# EAGLE design H09R9 (EAGLE 9.6.1)

## Sheet 1 of 2
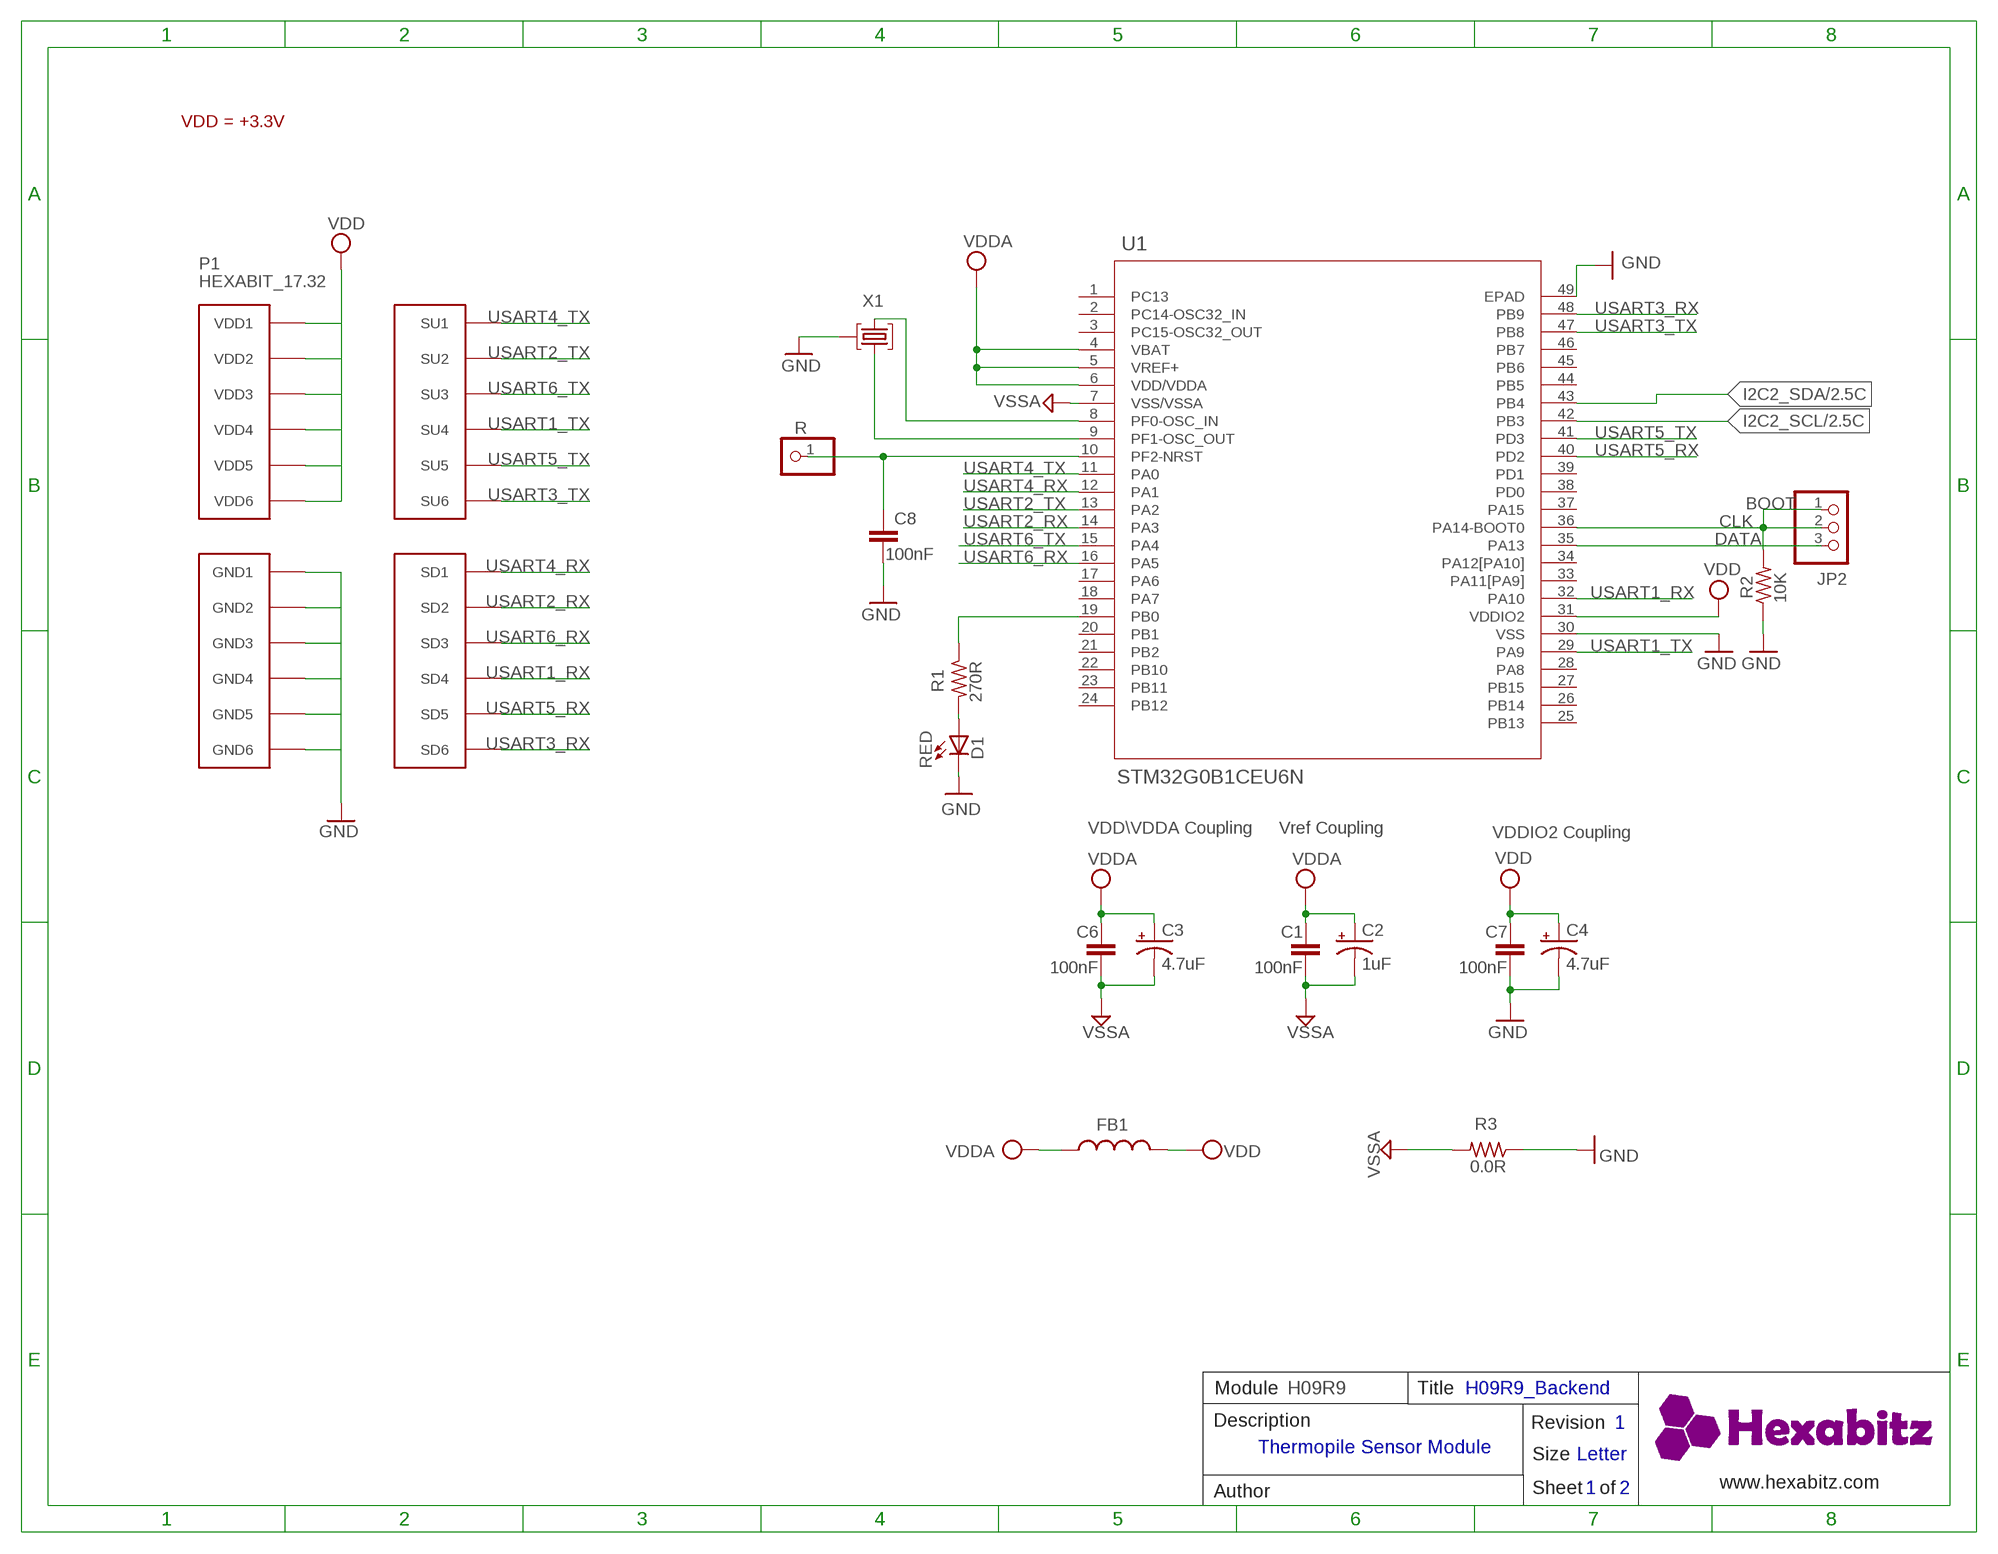
[diagram p0: schematic, sheet 1]

### Parts
C1  100nF  C-0603  [C-0603]
C2  1uF  C-0805-POL  [C-0805-POL]
C3  4.7uF  C-0805-POL  [C-0805-POL]
C4  4.7uF  C-0805-POL  [C-0805-POL]
C6  100nF  C-0603  [C-0603]
C7  100nF  C-0603  [C-0603]
C8  100nF  C-0603  [C-0603]
D1  RED  VLMS1300-GS08  [VLMS1300-GS08]
FB1  FB-TDK_MMZ1608Y300B  [FB-TDK_MMZ1608Y300B]
JP2  PINHD-1X3  [1X03]
P1  HEXABIT_17.32  [HEXABIT_17.32]
R  R  PINHD-1X1  [1X01]
R1  270R  R-0603  [R-0603]
R2  10K  R-0603  [R-0603]
R3  0.0R  R-0603  [R-0603]
U1  STM32G0B1CEU6N  [HEXABITZ_ICS_QFN_B1CEU6_STM-L]
X1  XTALL_CSTCE8M00G52  [XTALL_CSTCE8M00G52]

### Nets
CLK: JP2.1 JP2.2 R2.2 U1.36(PA14-BOOT0)
DATA: JP2.3 U1.35(PA13)
GND: C4.2(-) C7.2 C8.2 D1.C P1.PAD_PD7(GND1) P1.PAD_PD8(GND2) P1.PAD_PD9(GND3) P1.PAD_PD10(GND4) P1.PAD_PD11(GND5) P1.PAD_PD12(GND6) R2.1 R3.1 U1.30(VSS) U1.49(EPAD) X1.P$2 ; also sheet 2
I2C2_SCL: U1.42(PB3) ; also sheet 2
I2C2_SDA: U1.43(PB4) ; also sheet 2
N$1: R1.1 U1.19(PB0)
N$3: D1.A R1.2
N$4: C8.1 R.1 U1.10(PF2-NRST)
N$5: U1.9(PF1-OSC_OUT) X1.P$1
N$6: U1.8(PF0-OSC_IN) X1.P$3
USART1_RX: P1.PAD_PD4(SD4) U1.32(PA10)
USART1_TX: P1.PAD_PU4(SU4) U1.29(PA9)
USART2_RX: P1.PAD_PD2(SD2) U1.14(PA3)
USART2_TX: P1.PAD_PU2(SU2) U1.13(PA2)
USART3_RX: P1.PAD_PD6(SD6) U1.48(PB9)
USART3_TX: P1.PAD_PU6(SU6) U1.47(PB8)
USART4_RX: P1.PAD_PD1(SD1) U1.12(PA1)
USART4_TX: P1.PAD_PU1(SU1) U1.11(PA0)
USART5_RX: P1.PAD_PD5(SD5) U1.40(PD2)
USART5_TX: P1.PAD_PU5(SU5) U1.41(PD3)
USART6_RX: P1.PAD_PD3(SD3) U1.16(PA5)
USART6_TX: P1.PAD_PU3(SU3) U1.15(PA4)
VDD: C4.1(+) C7.1 FB1.2 P1.PAD_PU7(VDD1) P1.PAD_PU8(VDD2) P1.PAD_PU9(VDD3) P1.PAD_PU10(VDD4) P1.PAD_PU11(VDD5) P1.PAD_PU12(VDD6) U1.31(VDDIO2) ; also sheet 2
VDDA: C1.1 C2.1(+) C3.1(+) C6.1 FB1.1 U1.4(VBAT) U1.5(VREF+) U1.6(VDD/VDDA)
VSSA: C1.2 C2.2(-) C3.2(-) C6.2 R3.2 U1.7(VSS/VSSA)
Unconnected: U1.1(PC13) U1.2(PC14-OSC32_IN) U1.3(PC15-OSC32_OUT) U1.17(PA6) U1.18(PA7) U1.20(PB1) U1.21(PB2) U1.22(PB10) U1.23(PB11) U1.24(PB12) U1.25(PB13) U1.26(PB14) U1.27(PB15) U1.28(PA8) U1.33(PA11[PA9]) U1.34(PA12[PA10]) U1.37(PA15) U1.38(PD0) U1.39(PD1) U1.44(PB5) U1.45(PB6) U1.46(PB7)

### Notes on the sheet
- VDD = +3.3V
- BOOT
- VDD\VDDA Coupling | Vref Coupling | VDDIO2 Coupling
- Module | H09R9 | Title | H09R9_Backend
- Description | Revision | 1
- Thermopile Sensor Module
- Size | Letter
- www.hexabitz.com
- Author | Sheet   of | 1 | 2
- C:/Users/Admin/Desktop/logodraft.bmp

## Sheet 2 of 2
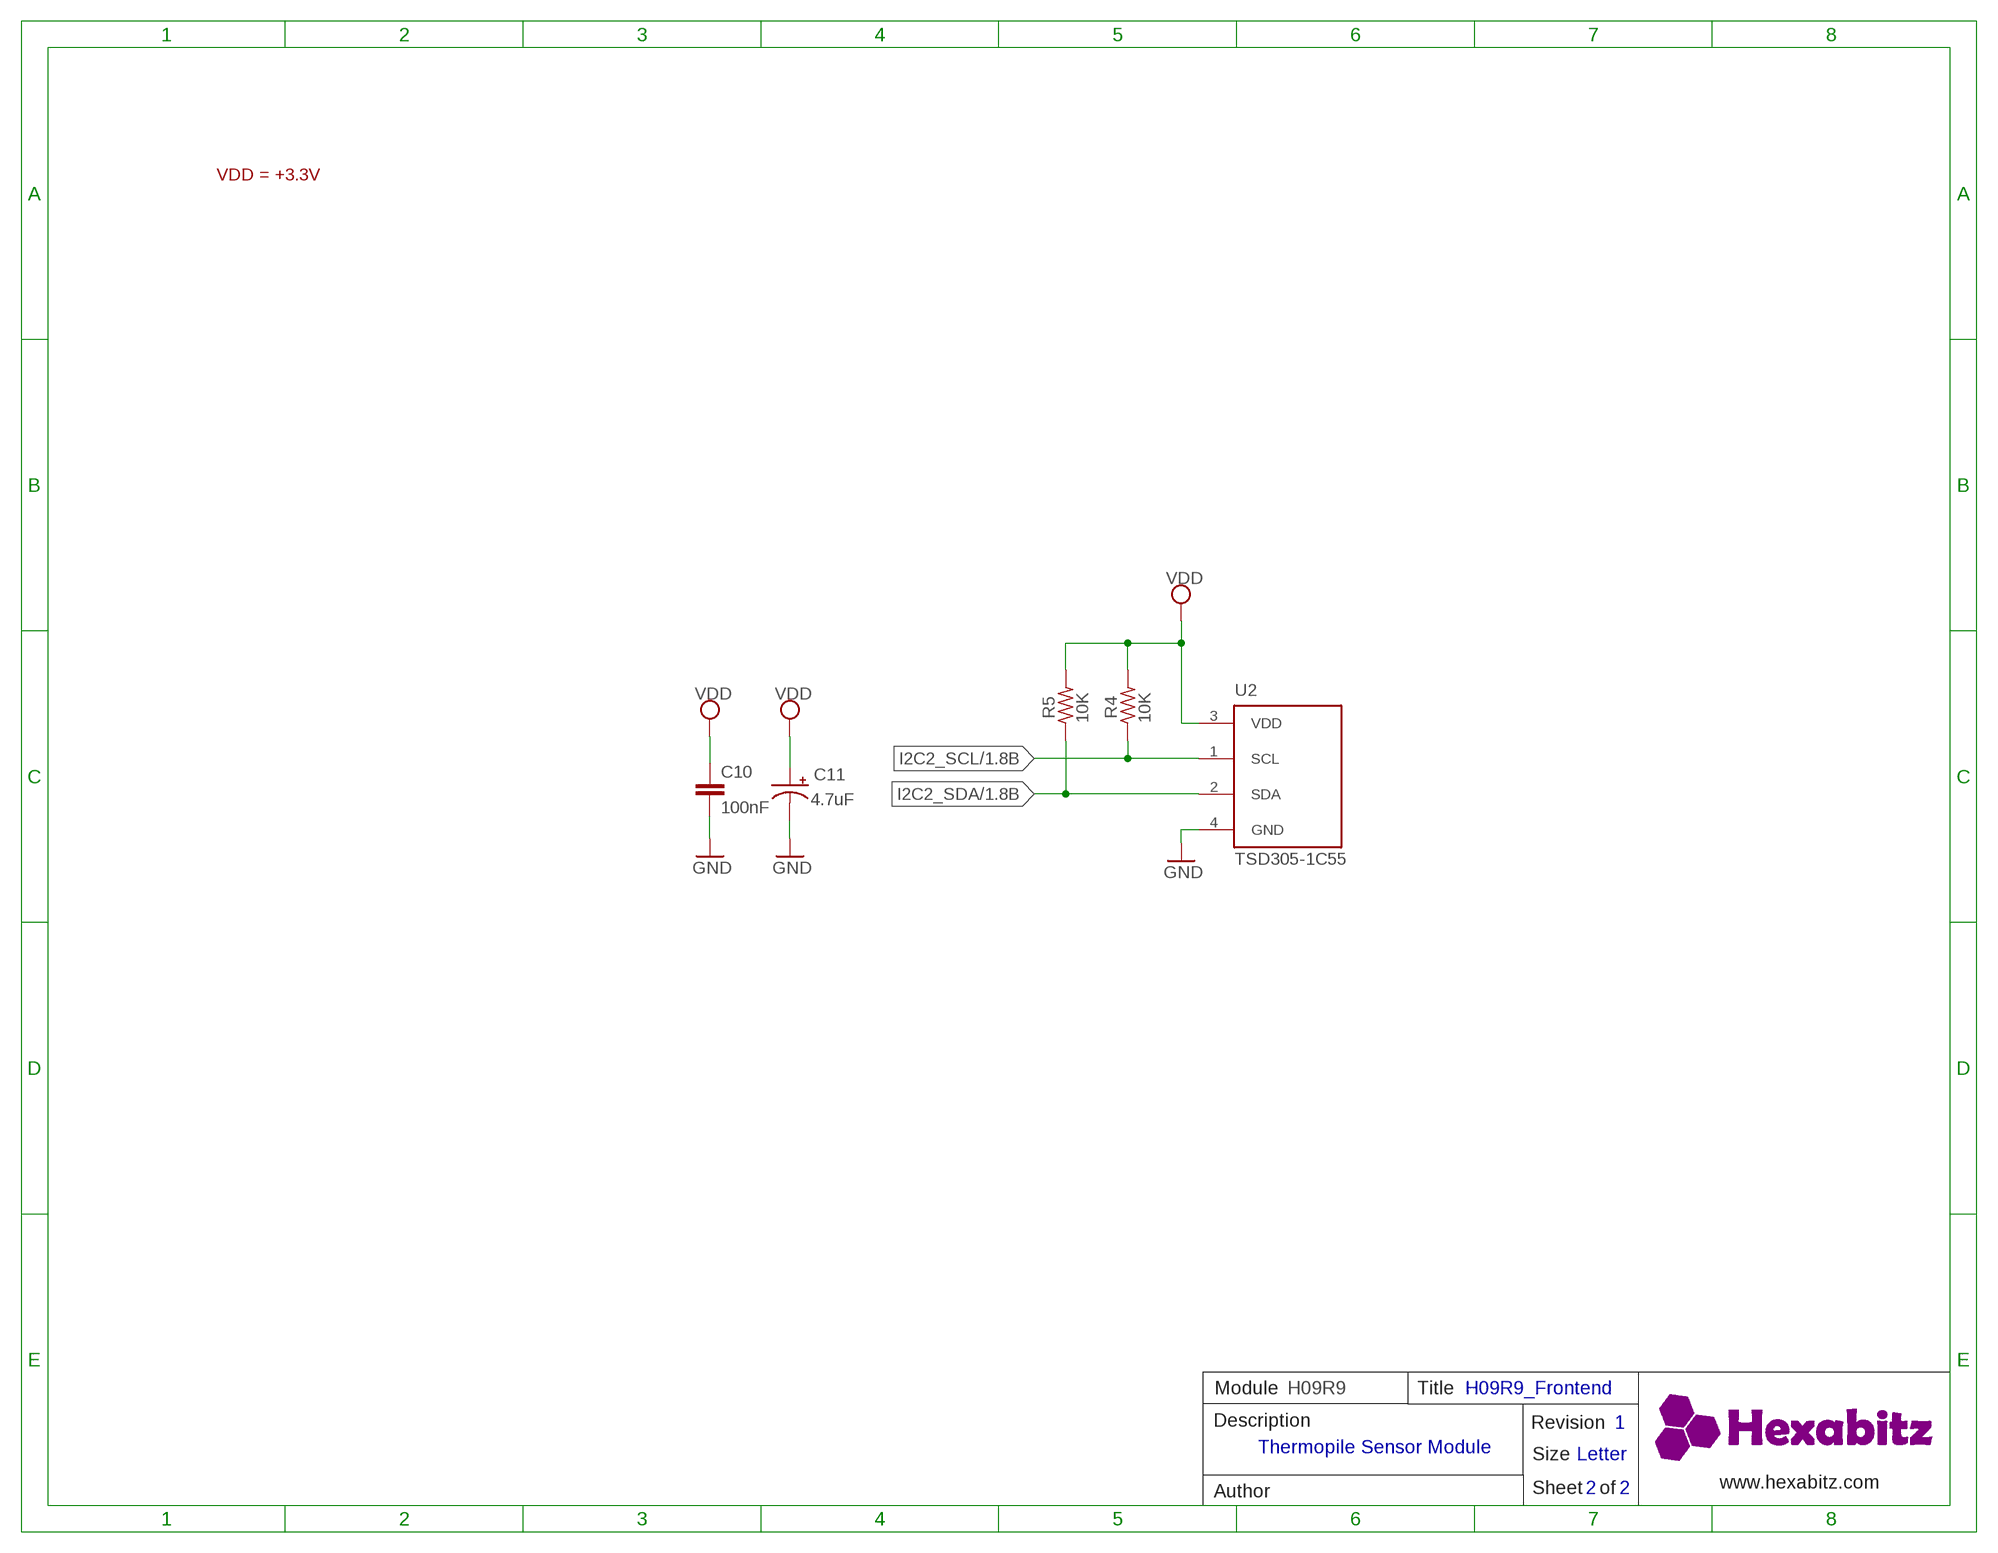
[diagram p1: schematic, sheet 2]

### Parts
C10  100nF  C-0603  [C-0603]
C11  4.7uF  C-0805-POL  [C-0805-POL]
R4  10K  R-0603  [R-0603]
R5  10K  R-0603  [R-0603]
U2  TSD305-1C55  [TEMPERATURESENSOR-TO5]

### Nets
GND: C10.2 C11.2(-) U2.4(GND) ; also sheet 1
I2C2_SCL: R4.1 U2.1(SCL) ; also sheet 1
I2C2_SDA: R5.1 U2.2(SDA) ; also sheet 1
VDD: C10.1 C11.1(+) R4.2 R5.2 U2.3(VDD) ; also sheet 1

### Notes on the sheet
- VDD = +3.3V
- Module | H09R9 | Title | H09R9_Frontend
- Description | Revision | 1
- Thermopile Sensor Module
- Size | Letter
- www.hexabitz.com
- Author | Sheet   of | 2 | 2

## Library data of the parts
C1 C6-C8 = HEXABITZ_RCLS:C-0603: CAP CER 10% X7R 0603
C2-C4 = HEXABITZ_RCLS:C-0805-POL: Cap Tant Solid SMD 2012
C10 = HEXABITZ_RCLS:C-0603: CAP CER 10% X7R 0603; CAPACITANCE: 100nF; MFN: AVX; MPN: 0603YC104K4T2A; OCTOPART_URL: https://octopart.com/0603yc104k4t2a-avx+interconnect+%2F+elco-8120651; TOLERANCE: 10%; VOLTAGE_RATING: 16.0 V
C11 = HEXABITZ_RCLS:C-0805-POL: Cap Tant Solid SMD 2012; CAPACITANCE: 4.7uF; MFN: Panasonic; MPN: 10TPU4R7MSI; OCTOPART_URL: https://octopart.com/10tpu4r7msi-panasonic-29487748; TOLERANCE: 20%; VOLTAGE_RATING: 10.0 V
D1 = HEXABITZ_USER_INTERFACE_PARTS:VLMS1300-GS08: Red 0603 130° Clear 54 mcd 2 V Surface Mount ChipLED ; Octopart Url : http://octopart.com/vlms1300-gs08-vishay-21709201; MFN: Vishay; MPN: VLMS1300-GS08; OCTOPART_URL: https://octopart.com/vlms1300-gs08-vishay-21709201?r=sp&s=_gcP4_q8T1SC6PJQPTQ9yA
FB1 = HEXABITZ_RCLS:FB-TDK_MMZ1608Y300B: Ferrite Beads Multi-Layer 30Ohm 25% 100MHz 1.5A 50mOhm DCR 0603; MFN: TDK; MPN: MMZ1608Y300B; OCTOPART_URL: https://octopart.com/mmz1608y300b-tdk-368280?r=sp&s=cd9_2ZEqQ9q9UNBuQgHAiA
JP2 = pinhead:PINHD-1X3: PIN HEADER
P1 = hexabitz_connectors:HEXABIT_?: Hexabitz Hexagon Module Connector Hexagon side length = 28.87mm.
R = HEXABITZ_USER_INTERFACE_PARTS:PINHD-1X1: PIN HEADER; MFN: TE Connectivity; MPN: 87227-1; OCTOPART_URL: https://octopart.com/87227-1-te+connectivity-39512052?r=sp
R1 R2 R4 R5 = HEXABITZ_RCLS:R-0603: Thick Film Resistors - SMD 0603
R3 = HEXABITZ_RCLS:R-0603: Thick Film Resistors - SMD 0603; MFN: Yageo; MPN: RC0603JR-070RL; OCTOPART_URL: https://octopart.com/rc0603jr-070rl-yageo-1241539?r=sp&s=X2NteqRjRNWrnx42Y0aliA; RESISTANCE: 0.0 Ohm
U1 = HEXABITZ_ICs:STM32G0B1CEU6N
U2 = HEXABITZ_ICs:TSD305-1C55: I2C DIGITAL THERMOPILE SENSOR; MFN: TE Connectivity; MPN: G-TPMO-101; OCTOPART_URL: https://octopart.com/g-tpmo-101-te+connectivity-76900424?r=sp
X1 = HEXABITZ_RCLS:XTALL_CSTCE8M00G52: MURATA CSTCE8M00G52-R0 RESONATOR, SMD, 8MHZ ; Octopart Url : https://octopart.com/cstce8m00g52-r0-murata-7145559; MFN: Murata; MPN: CSTCE8M00G52Z-R0; OCTOPART_URL: https://octopart.com/cstce8m00g52z-r0-murata-17755941?r=sp&s=JDnNJnrHQhyS8Zk4ofFWXw

## Board
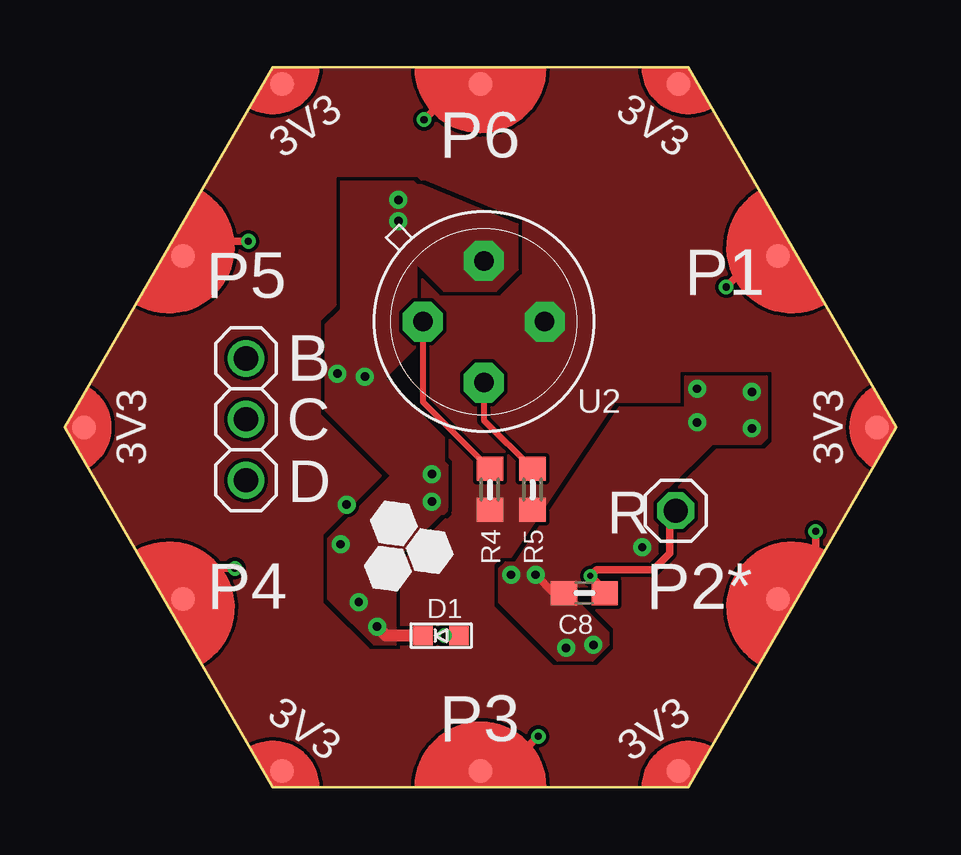
[diagram p2: board, top side]
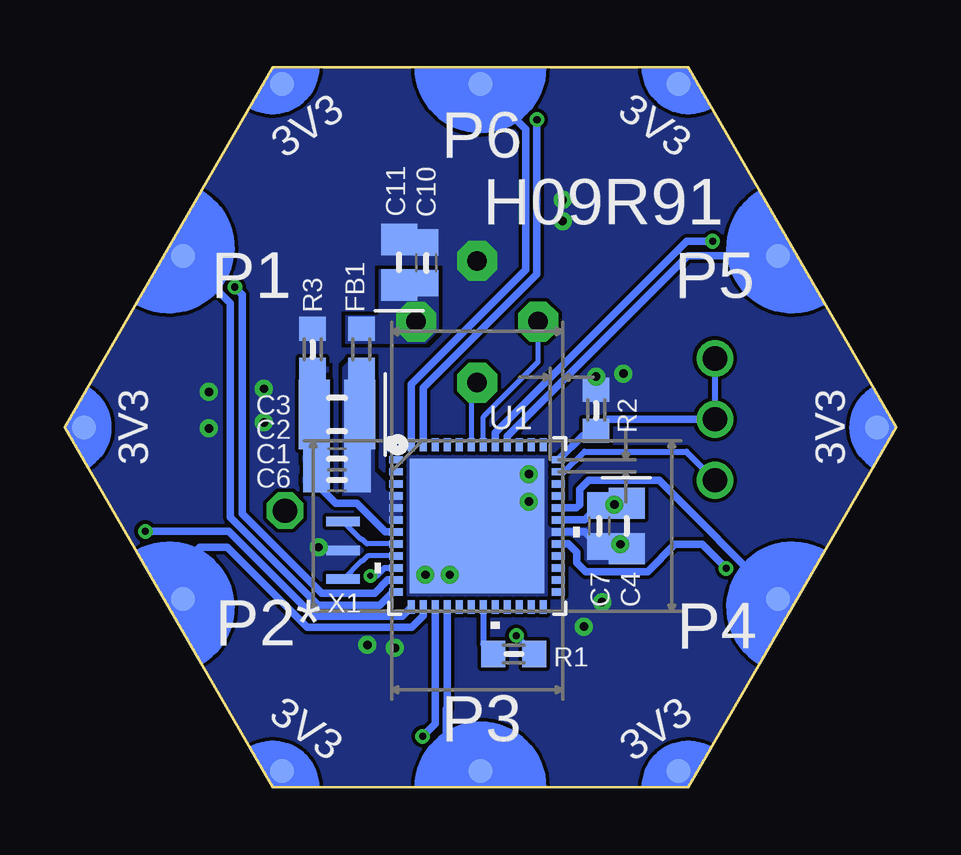
[diagram p3: board, bottom side, seen from below]

Size 34.64 x 30 mm. Coordinates in mm from the lower left corner, seen from the top.
Copper layers (1*16): Top 0.035mm / dielectric 1.5mm / Bottom 0.035mm
Design rules "2_layer *": minimum track width 7mil, minimum drill 0.2mm, track to track 6mil, track to pad 6mil, pad to pad 6mil, via to via 6mil, smd to smd 0mil, copper to edge 0mil, drill to drill 8mil, minimum pad ring 10mil, minimum via ring 6mil, stop-mask expansion 2mil, vias tented up to drill 15mil, thermal gap 10mil

### Footprints (pad centres in the part's own frame; a part is rotated, then mirrored left to right if it is on the bottom)
C-0603 = smd 1.1 x 1: 1 -0.85,0; 2 0.85,0
C-0805-POL = smd 1.3 x 1.5: 1 -0.95,0; 2 0.95,0
VLMS1300-GS08 = smd 0.8 x 0.8: A 0,0.75; C 0,-0.75
FB-TDK_MMZ1608Y300B = smd 1 x 1.1: 1 -0.85,0; 2 0.85,0
1X03 = drill 1.016: 1 -2.54,0; 2 0,0; 3 2.54,0
HEXABIT_17.32 = smd 1 x 1 bottom: PAD_PD1 12.39,7.15; PAD_PD2 12.39,-7.15; PAD_PD3 0,-14.31; PAD_PD4 -12.39,-7.15; PAD_PD5 -12.39,7.15; PAD_PD6 0,14.31; PAD_PD7 8.26,14.31; PAD_PD8 16.52,0; PAD_PD9 8.26,-14.31; PAD_PD10 -8.26,-14.31; PAD_PD11 -16.52,0; PAD_PD12 -8.26,14.31 | smd 1 x 1: PAD_PU1 12.39,7.15; PAD_PU2 12.39,-7.15; PAD_PU3 0,-14.31; PAD_PU4 -12.39,-7.15; PAD_PU5 -12.39,7.15; PAD_PU6 0,14.31; PAD_PU7 8.26,14.31; PAD_PU8 16.52,0; PAD_PU9 8.26,-14.31; PAD_PU10 -8.26,-14.31; PAD_PU11 -16.52,0; PAD_PU12 -8.26,14.31
1X01 = drill 1.016 octagon: 1 0,0
R-0603 = smd 1 x 1.1: 1 -0.85,0; 2 0.85,0
HEXABITZ_ICS_QFN_B1CEU6_STM-L = smd 0.55 x 0.297: 1 -3.38,2.751; 2 -3.38,2.251; 3 -3.38,1.75; 4 -3.38,1.25; 5 -3.38,0.75; 6 -3.38,0.25; 7 -3.38,-0.25; 8 -3.38,-0.75; 9 -3.38,-1.25; 10 -3.38,-1.75; 11 -3.38,-2.251; 12 -3.38,-2.751; 25 3.38,-2.751; 26 3.38,-2.251; 27 3.38,-1.75; 28 3.38,-1.25; 29 3.38,-0.75; 30 3.38,-0.25; 31 3.38,0.25; 32 3.38,0.75; 33 3.38,1.25; 34 3.38,1.75; 35 3.38,2.251; 36 3.38,2.751 | smd 0.297 x 0.55: 13 -2.751,-3.38; 14 -2.251,-3.38; 15 -1.75,-3.38; 16 -1.25,-3.38; 17 -0.75,-3.38; 18 -0.25,-3.38; 19 0.25,-3.38; 20 0.75,-3.38; 21 1.25,-3.38; 22 1.75,-3.38; 23 2.251,-3.38; 24 2.751,-3.38; 37 2.751,3.38; 38 2.251,3.38; 39 1.75,3.38; 40 1.25,3.38; 41 0.75,3.38; 42 0.25,3.38; 43 -0.25,3.38; 44 -0.75,3.38; 45 -1.25,3.38; 46 -1.75,3.38; 47 -2.251,3.38; 48 -2.751,3.38 | smd 5.6 x 5.6: 49 0,0
TEMPERATURESENSOR-TO5 = drill 0.813 pad 1.676 octagon: 1 2.54,0; 2 0,2.54; 3 -2.54,0; 4 0,-2.54
XTALL_CSTCE8M00G52 = smd 1.4 x 0.4: P$1 0,1.2; P$2 0,0; P$3 0,-1.2

### Placement (x,y rotation side)
C1  23.3,13.69 180 bottom
C2  23.3,14.83 180 bottom
C3  23.3,16.23 180 bottom
C4  11.23,10.9 270 bottom
C6  23.3,12.8 180 bottom
C7  12.38,10.9 270 bottom
C8  21.65,8.1 180 top
C10  19.57,21.86 90 bottom
C11  20.71,21.88 90 bottom
D1  15.68,6.32 270 top
FB1  22.28,18.26 90 bottom
JP2  7.55,15.34 270 top
P1  17.32,15 0 top
R  25.46,11.53 0 top
R1  15.93,5.56 0 bottom
R2  12.5,15.72 270 bottom
R3  24.32,18.26 270 bottom
R4  17.71,12.42 270 top
R5  19.49,12.42 270 top
U1  17.46,10.9 0 bottom
U2  17.46,19.4 180 top
X1  23.05,9.88 180 bottom

### Tracks (layer width: path | path; a pad name or v marks a point on that pad's centre or on a via)
CLK
  Bottom 0.254: JP2.1 JP2.2
  Bottom 0.305: U1.36 13.06,14.66 12.71,14.66 R2.2 12.04,15.34 JP2.2
DATA
  Bottom 0.254: U1.35 13.83,13.15 12.98,13.99 8.75,13.99 JP2.3
GND  (via drill 0.35 pad 0.75)
  Top 0.305: C8.2 20.38,8.1 v19.62,8.86
  Top 0.508: D1.C 13.39,6.32 v13.01,6.7
  Bottom 0.305: U1.30 12.98,10.65 C7.2 11.33,10.04 C4.2
  other vias: 13.9,24.48 13.9,23.59 11.36,17.24 12.5,17.12 15.3,13.05 15.3,11.91 11.49,10.13 12.25,7.72 20.89,5.82 22.03,5.94 28.63,16.48 28.63,14.96 26.35,15.21 26.35,16.61 24.06,10.01 18.6,8.86
  pour Bottom (rank 2, no thermals): 8.67,0.04 25.93,0.04 34.58,15.03 25.99,29.91 8.65,29.91 0.04,14.99
  pour Top (no thermals): 25.84,17.12 25.84,14.83 26.35,14.32 29.01,14.32 29.27,14.58 29.27,17.12
  pour Top (no thermals): 18.85,23.47 18.85,21.56 17.97,20.67 15.81,20.67 13.39,23.09 13.27,23.21 13.27,25.12 14.87,25.12
  pour Top: 12.89,16.61 14.66,18.39 14.66,25.12 14.54,25.25 11.49,25.25 11.49,19.91 10.85,19.28 10.85,16.74 10.98,16.61
  pour Top: 13.77,5.94 12.89,5.94 11.11,7.72 10.98,7.85 10.98,10.39 14.16,13.56 15.81,13.56 15.93,13.44 15.93,11.66 13.77,9.5
  pour Top: 10.85,17.5 10.85,15.72 15.17,11.4 15.81,11.4 15.93,11.53 15.93,13.44 15.81,13.56 15.81,14.58 12.89,17.5 12.63,17.75 10.98,17.75 10.85,17.63
  pour Top (no thermals): 22.66,5.94 22.66,6.45 19.74,9.37 18.35,9.37 18.09,9.12 18.09,8.48 18.09,7.72 20.51,5.31 22.03,5.31
  pour Top (no thermals): 23.55,8.36 18.12,8.36 18.12,8.36 23.13,15.85 26.98,15.85 27.36,15.47 27.36,14.71 24.7,12.04 24.7,9.5
I2C2_SCL
  Top 0.254: U2.1 14.92,16.06 R4.1
  Bottom 0.203: U1.42 17.21,15.42 17.16,15.46 17.16,15.48 14.92,17.73 U2.1
I2C2_SDA
  Top 0.254: U2.2 17.46,15.3 R5.1
  Bottom 0.203: U2.2 17.71,16.61 U1.43
N$1
  Bottom 0.254: U1.19 17.21,5.99 R1.1
N$3  (via drill 0.3 pad 0.6)
  Top 0.254: v15.83,6.32 D1.A
  Bottom 0.254: R1.2 15.08,5.58 v15.83,6.32
N$4  (via drill 0.25 pad 0.55)
  Top 0.305: R.1 25.2,11.28 25.2,9.75 24.52,9.07 22.16,9.07 v21.9,8.81 22.5,8.22 C8.1
  Bottom 0.254: v21.9,8.81 21.65,8.81 21.32,9.15 U1.10
N$5
  Bottom 0.203: X1.P$1 22.3,9.43 22.24,9.43 22.02,9.65 U1.9
N$6
  Bottom 0.203: X1.P$3 22.3,10.33 22.24,10.33 22.05,10.15 U1.8
USART1_RX
  Bottom 0.305: P1.PAD_PD4 9.88,12.8 12.8,12.8 13.18,12.42 13.18,11.78 13.32,11.65 U1.32
USART1_TX  (via drill 0.3 pad 0.6)
  Top 0.305: v7.08,9.13 6.21,9.13 P1.PAD_PU4
  Bottom 0.305: U1.29 13.66,10.15 13.31,9.79 13.31,9.37 12.93,8.99 10.36,8.99 9.22,10.13 8.09,10.13 v7.08,9.13
USART2_RX
  Bottom 0.305: U1.14 19.71,7.16 20.19,6.68 24.54,6.68 27.87,10.01 29.01,10.01 29.71,9.31 P1.PAD_PD2
USART2_TX  (via drill 0.3 pad 0.6)
  Top 0.305: P1.PAD_PU2 30.98,9.12 31.29,9.65 v31.29,10.67
  Bottom 0.305: U1.13 20.59,7.14 24.26,7.14 27.8,10.67 v31.29,10.67
USART3_RX
  Bottom 0.305: U1.48 20.21,16.79 15.43,21.58 15.43,27.41 P1.PAD_PD6
USART3_TX  (via drill 0.3 pad 0.6)
  Top 0.305: v14.97,27.82 16.46,29.31 P1.PAD_PU6
  Bottom 0.305: U1.47 19.71,16.65 14.97,21.38 v14.97,27.82
USART4_RX
  Bottom 0.305: U1.12 20.96,8.14 21.52,7.59 24.07,7.59 27.74,11.26 27.74,20.18 P1.PAD_PD1
USART4_TX  (via drill 0.3 pad 0.6)
  Top 0.305: v27.55,20.85 28.85,22.15 P1.PAD_PU1
  Bottom 0.305: U1.11 21.19,8.64 21.74,8.1 23.93,8.1 27.24,11.4 27.24,20.54 v27.55,20.85
USART5_RX
  Bottom 0.305: U1.40 16.21,14.63 8.69,22.15 P1.PAD_PD5
USART5_TX  (via drill 0.3 pad 0.6)
  Top 0.305: v7.65,22.76 5.54,22.76 P1.PAD_PU5
  Bottom 0.305: U1.41 16.71,14.78 8.73,22.76 v7.65,22.76
USART6_RX
  Bottom 0.305: P1.PAD_PD3 18.75,2.12 18.75,3.28 18.71,3.32 U1.16
USART6_TX  (via drill 0.3 pad 0.6)
  Top 0.305: v19.73,2.13 18.29,0.69 P1.PAD_PU3
  Bottom 0.305: U1.15 19.21,2.65 v19.73,2.13
VDD  (via drill 0.35 pad 0.75)
  Bottom 0.305: U1.31 12.98,11.15 C7.1 | C7.1 11.78,11.75 v11.74,11.78 | C4.1 12.28,11.85 C7.1
  pour Top (rank 2, no thermals): 8.75,0.04 25.87,0.04 34.53,15.04 25.94,29.91 8.69,29.91 0.1,15.02
  pour Bottom (no thermals): 19.11,21.56 19.11,19.02 19.62,18.52 22.92,18.52 22.92,19.66 21.52,19.66 21.52,21.56
VDDA
  pour Bottom (no thermals): 20.63,11.02 21.9,11.02 23.05,12.17 23.05,17.5 22.66,17.88 21.78,17.88 21.78,13.18 21.01,12.42 20.63,12.42
VSSA
  Bottom 0.305: U1.7 21.28,10.65 22.48,11.84 23.35,11.84 24.19,12.67 24.19,12.76 C6.2
  Bottom 0.406: R3.2 24.32,16.3 C3.2 | C2.2 24.25,13.79 C1.2
  pour Bottom: 24.57,12.29 24.7,12.42 24.7,17.88 23.68,17.88 23.68,12.29

### Text on the board
tPlace: 3V3 | 3V3 | P6 | P1 | P5 | 3V3 | 3V3 | P4 | P2* | P3 | 3V3 | 3V3
bPlace: 3V3 | 3V3 | P6 | H09R91 | P5 | P1 | 3V3 | 3V3 | P4 | P2* | P3 | 3V3 | 3V3
tNames: B | C | D